# EAGLE design main (EAGLE 5.11)
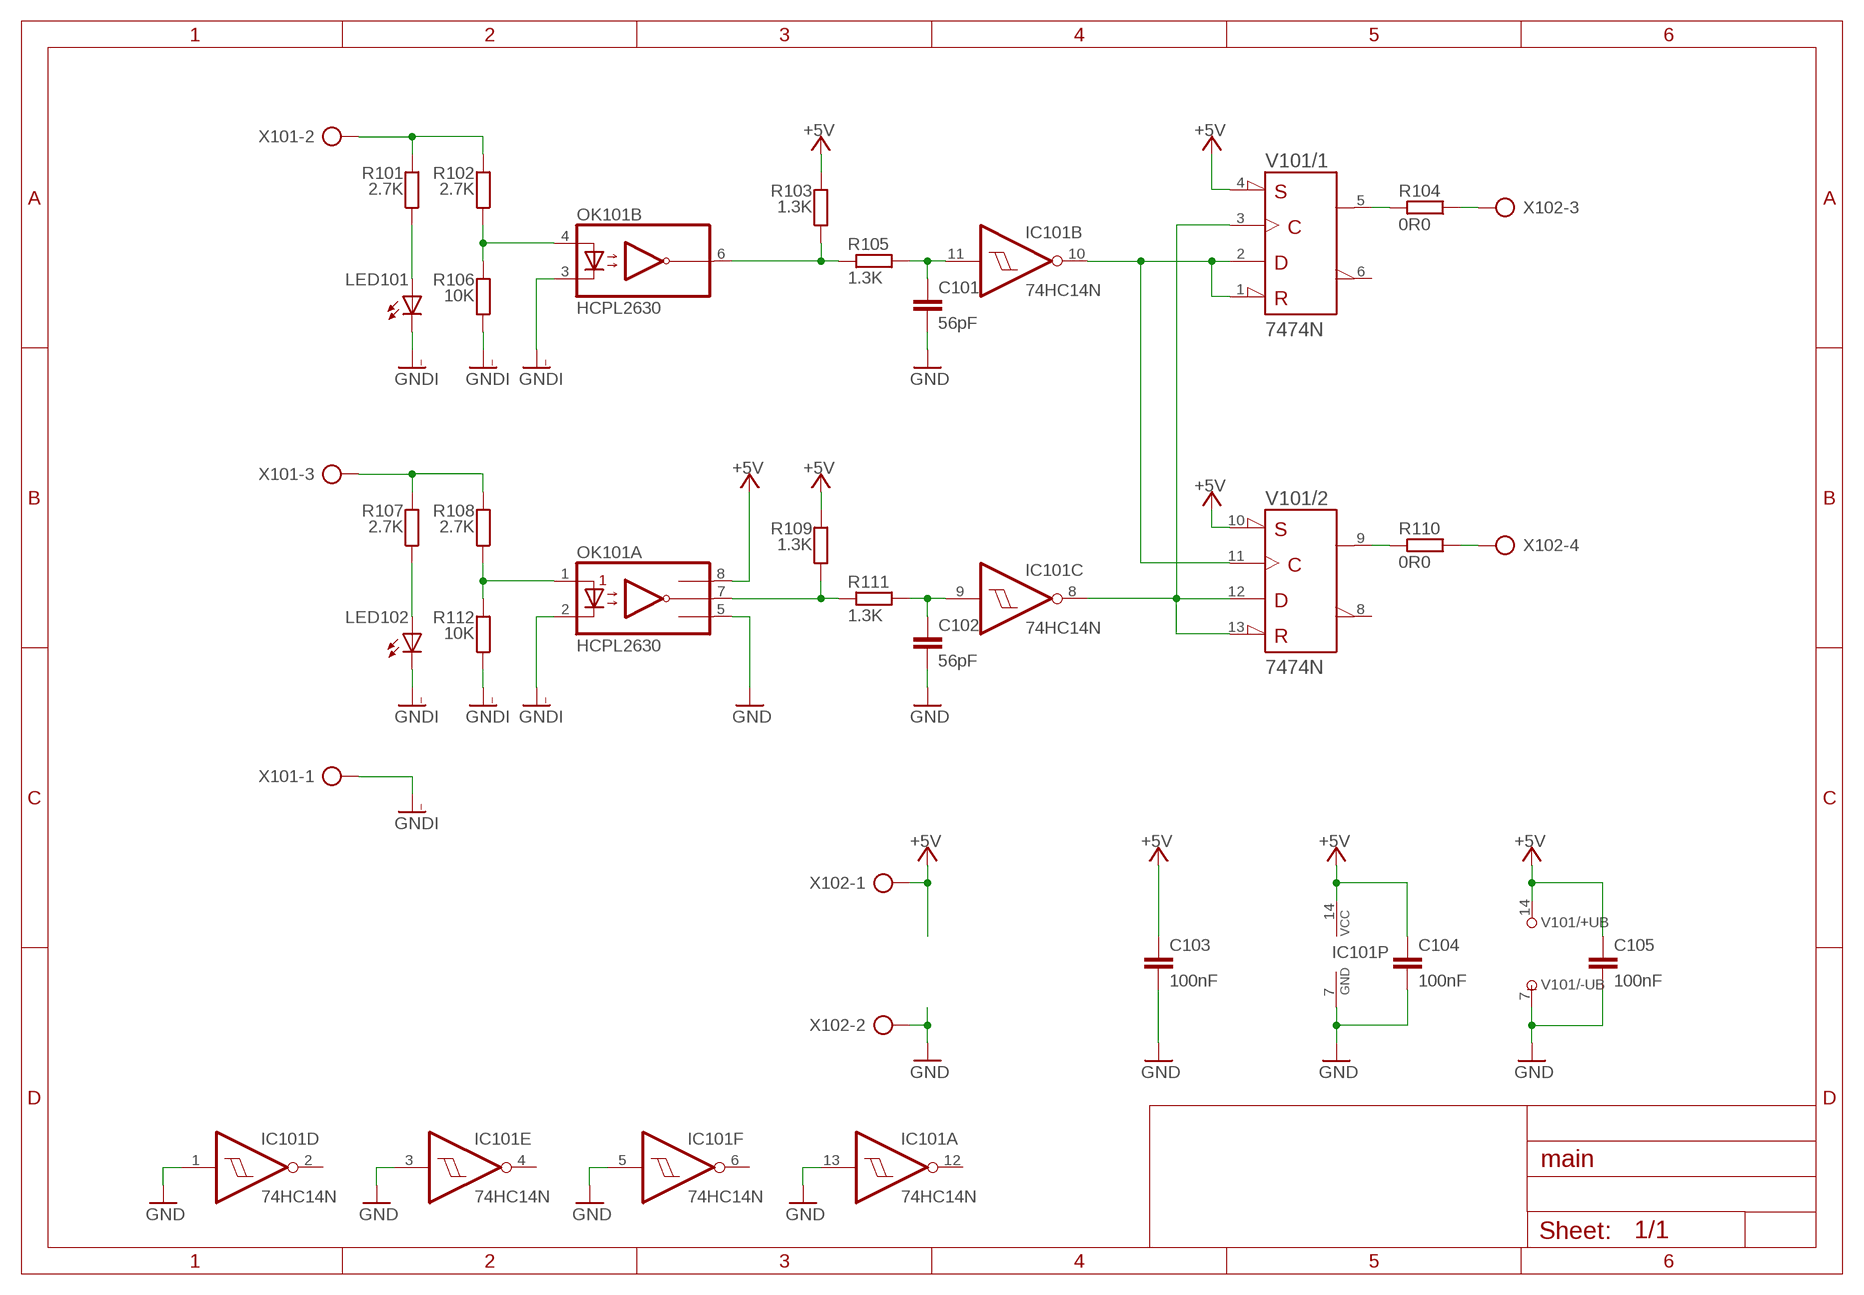
[diagram p0: schematic, sheet 1]

## Parts
C101  56pF  C-EU050-024X044  [C050-024X044]
C102  56pF  C-EU050-024X044  [C050-024X044]
C103  100nF  C-EUC1206  [C1206]
C104  100nF  C-EUC1206  [C1206]
C105  100nF  C-EUC1206  [C1206]
IC101  74HC14N  [DIL14]
LED101  LED5MM  [LED5MM]
LED102  LED5MM  [LED5MM]
OK101  HCPL2630  [DIL08]
R101  2.7K  R-EU_0204/7  [0204/7]
R102  2.7K  R-EU_0204/7  [0204/7]
R103  1.3K  R-EU_0204/7  [0204/7]
R104  0R0  R-EU_0204/7  [0204/7]
R105  1.3K  R-EU_0204/7  [0204/7]
R106  10K  R-EU_0204/7  [0204/7]
R107  2.7K  R-EU_0204/7  [0204/7]
R108  2.7K  R-EU_0204/7  [0204/7]
R109  1.3K  R-EU_0204/7  [0204/7]
R110  0R0  R-EU_0204/7  [0204/7]
R111  1.3K  R-EU_0204/7  [0204/7]
R112  10K  R-EU_0204/7  [0204/7]
V101  7474N  [DIL14]
X101  AK500/3-H  [AK500/3-H]
X102  AK500/4-H  [AK500/4-H]

## Nets
+5V: C103.1 C104.1 C105.1 IC101.14(P:VCC) OK101.8(A:VCC) R103.2 R109.2 V101.4(/1:!PRE) V101.10(/2:!PRE) V101.14(/+UB:+UB) X102.1
GND: C101.2 C102.2 C103.2 C104.2 C105.2 IC101.1(D:I) IC101.3(E:I) IC101.5(F:I) IC101.7(P:GND) IC101.13(A:I) OK101.5(A:GND) V101.7(/-UB:-UB) X102.2
GNDI: LED101.K(C) LED102.K(C) OK101.2(A:C1) OK101.3(B:C2) R106.1 R112.1 X101.1
N$1: OK101.6(B:VO2) R103.1 R105.2
N$2: OK101.7(A:VO1) R109.1 R111.2
N$3: C102.1 IC101.9(C:I) R111.1
N$4: C101.1 IC101.11(B:I) R105.1
N$6: R104.2 V101.5(/1:Q)
N$7: IC101.10(B:O) V101.1(/1:!CLR) V101.2(/1:D) V101.11(/2:CLK)
N$8: IC101.8(C:O) V101.3(/1:CLK) V101.12(/2:D) V101.13(/2:!CLR)
N$9: R110.2 V101.9(/2:Q)
N$10: R101.2 R102.2 X101.2
N$15: OK101.4(B:A2) R102.1 R106.2
N$16: OK101.1(A:A1) R108.1 R112.2
N$22: R107.2 R108.2 X101.3
N$23: LED101.A R101.1
N$24: LED102.A R107.1
N$25: R104.1 X102.3
N$26: R110.1 X102.4
Unconnected: IC101.2(D:O) IC101.4(E:O) IC101.6(F:O) IC101.12(A:O) V101.6(/1:!Q) V101.8(/2:!Q)

## Library data of the parts
C101-C105 = rcl:C-EU: CAPACITOR, European symbol
IC101 = 74xx-eu:74*14: Hex schmitt trigger INVERTER
LED101 LED102 = led:LED: LED OSRAM: - CHIPLED LG R971, LG N971, LY N971, LG Q971, LY Q971, LO R971, LY R971 LH N974, LH R974 LS Q976, LO Q976, LY Q976 LO Q996 - Hyper CHIPLED LW Q18S LB Q993, LB Q99A, LB R99A - SideLED LS A670, LO A670, LY A670, LG A670, LP A670 LB A673, LV A673, LT A673, LW A673 LH A674 LY A675 LS A676, LA A676, LO A676, LY A676, LW A676 LS A679, LY A679, LG A679 - Hyper Micro SIDELED® LS Y876, LA Y876, LO Y876, LY Y876 LT Y87S - SmartLED LW L88C, LW L88S LB L89C, LB L89S, LG L890 LS L89K, LO L89K, LY L89K LS L896, LA L896, LO L896, LY L896 - TOPLED LS T670, LO T670, LY T670, LG T670, LP T670 LSG T670, LSP T670, LSY T670, LOP T670, LYG T670 LG T671, LOG T671, LSG T671 LB T673, LV T673, LT T673, LW T673 LH T674 LS T676, LA T676, LO T676, LY T676, LB T676, LH T676, LSB T676, LW T676 LB T67C, LV T67C, LT T67C, LS T67K, LO T67K, LY T67K, LW E67C LS E67B, LA E67B, LO E67B, LY E67B, LB E67C, LV E67C, LT E67C LW T67C LS T679, LY T679, LG T679 LS T770, LO T770, LY T770, LG T770, LP T770 LB T773, LV T773, LT T773, LW T773 LH T774 LS E675, LA E675, LY E675, LS T675 LS T776, LA T776, LO T776, LY T776, LB T776 LHGB T686 LT T68C, LB T68C - Hyper Mini TOPLED® LB M676 - Mini TOPLED Santana® LG M470 LS M47K, LO M47K, LY M47K Source: http://www.osram.convergy.de LUXEON: - LUMILED® LXK2-PW12-R00, LXK2-PW12-S00, LXK2-PW14-U00, LXK2-PW14-V00 LXK2-PM12-R00, LXK2-PM12-S00, LXK2-PM14-U00 LXK2-PE12-Q00, LXK2-PE12-R00, LXK2-PE12-S00, LXK2-PE14-T00, LXK2-PE14-U00 LXK2-PB12-K00, LXK2-PB12-L00, LXK2-PB12-M00, LXK2-PB14-N00, LXK2-PB14-P00, LXK2-PB14-Q00 LXK2-PR12-L00, LXK2-PR12-M00, LXK2-PR14-Q00, LXK2-PR14-R00 LXK2-PD12-Q00, LXK2-PD12-R00, LXK2-PD12-S00 LXK2-PH12-R00, LXK2-PH12-S00 LXK2-PL12-P00, LXK2-PL12-Q00, LXK2-PL12-R00 Source: www.luxeon.com KINGBRIGHT: KA-3528ASYC Source: www.kingbright.com
OK101 = optocoupler:HCPL2630: HEWLETT PACKARD OPTO COUPLER; MF: AGILENT TECHNOLOGIES; MPN: HCPL-2630-000E; OC_FARNELL: 9994904; OC_NEWARK: 88H7813
R101-R112 = rcl:R-EU_: RESISTOR, European symbol
V101 = 74ttl-din:74*74: Dual D type positive edge triggered FLIP FLOP, preset and clear
X101 = con-ptr500:AK500/3-H: CONNECTOR Aug. 2004 / PTR Meßtechnik: Die Bezeichnung der Serie AK505 wurde geändert. Es handelt sich hierbei um AK500 in horizontaler Ausführung.; OC_FARNELL: unknown; OC_NEWARK: unknown
X102 = con-ptr500:AK500/4-H: CONNECTOR Aug. 2004 / PTR Meßtechnik: Die Bezeichnung der Serie AK505 wurde geändert. Es handelt sich hierbei um AK500 in horizontaler Ausführung.; OC_FARNELL: unknown; OC_NEWARK: unknown

## Board
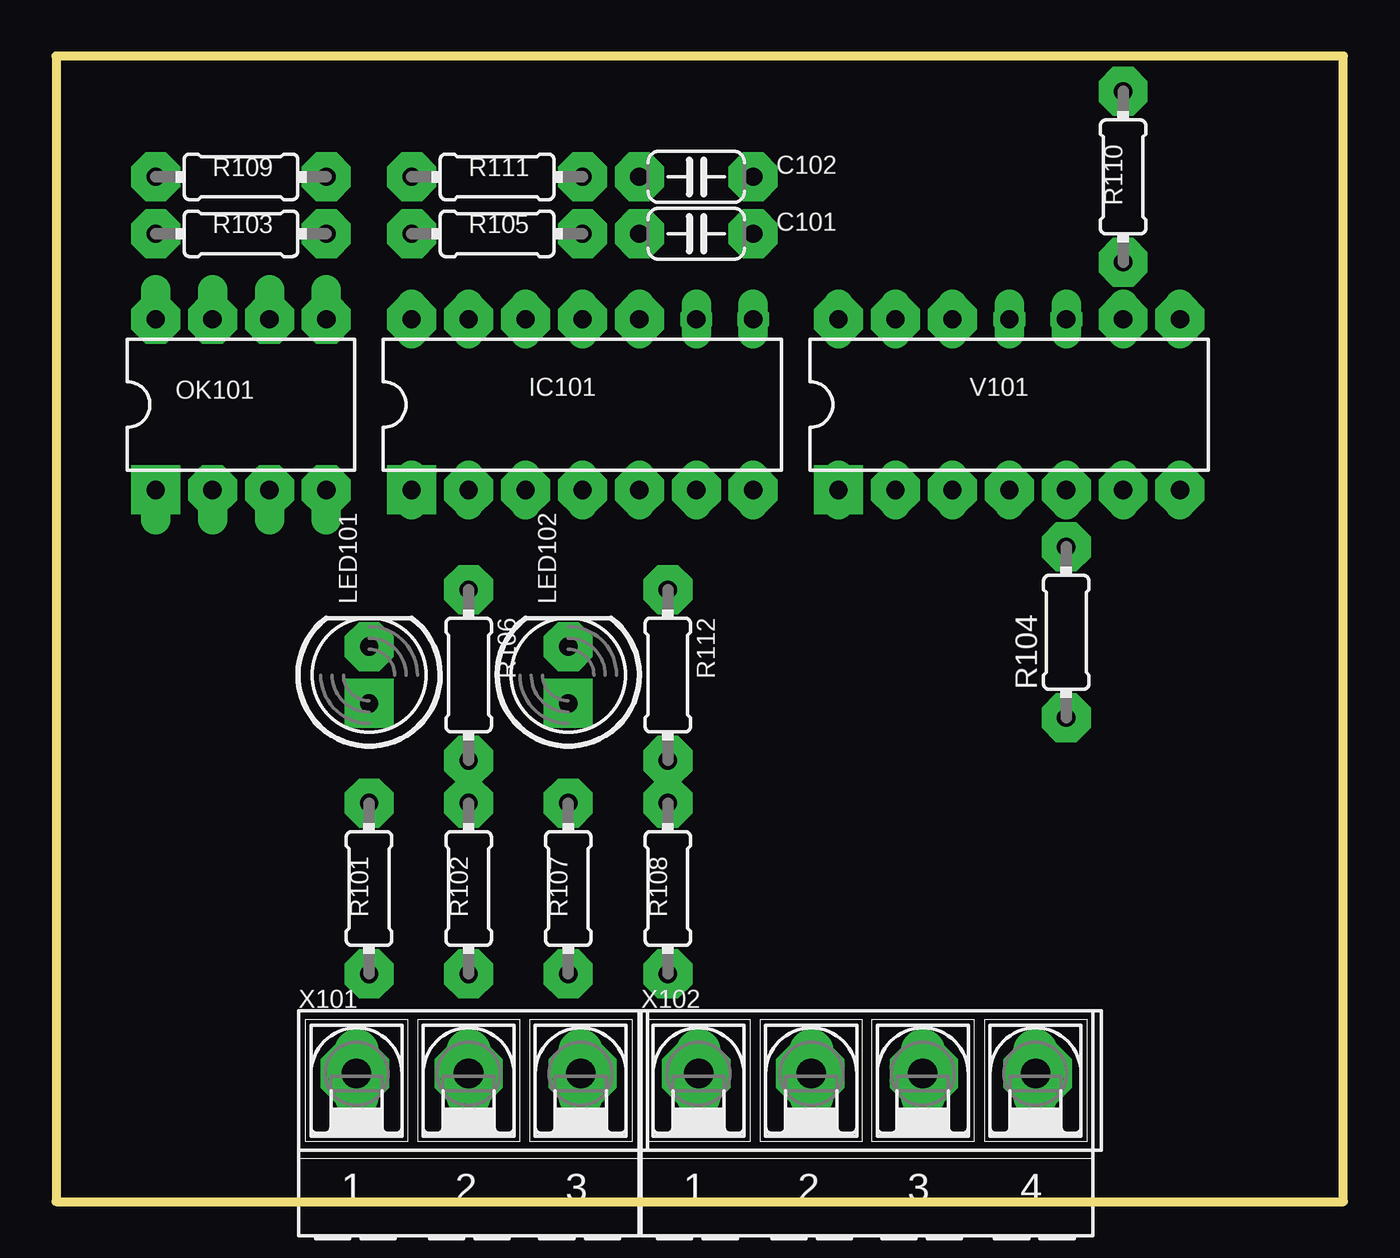
[diagram p1: board, top side]
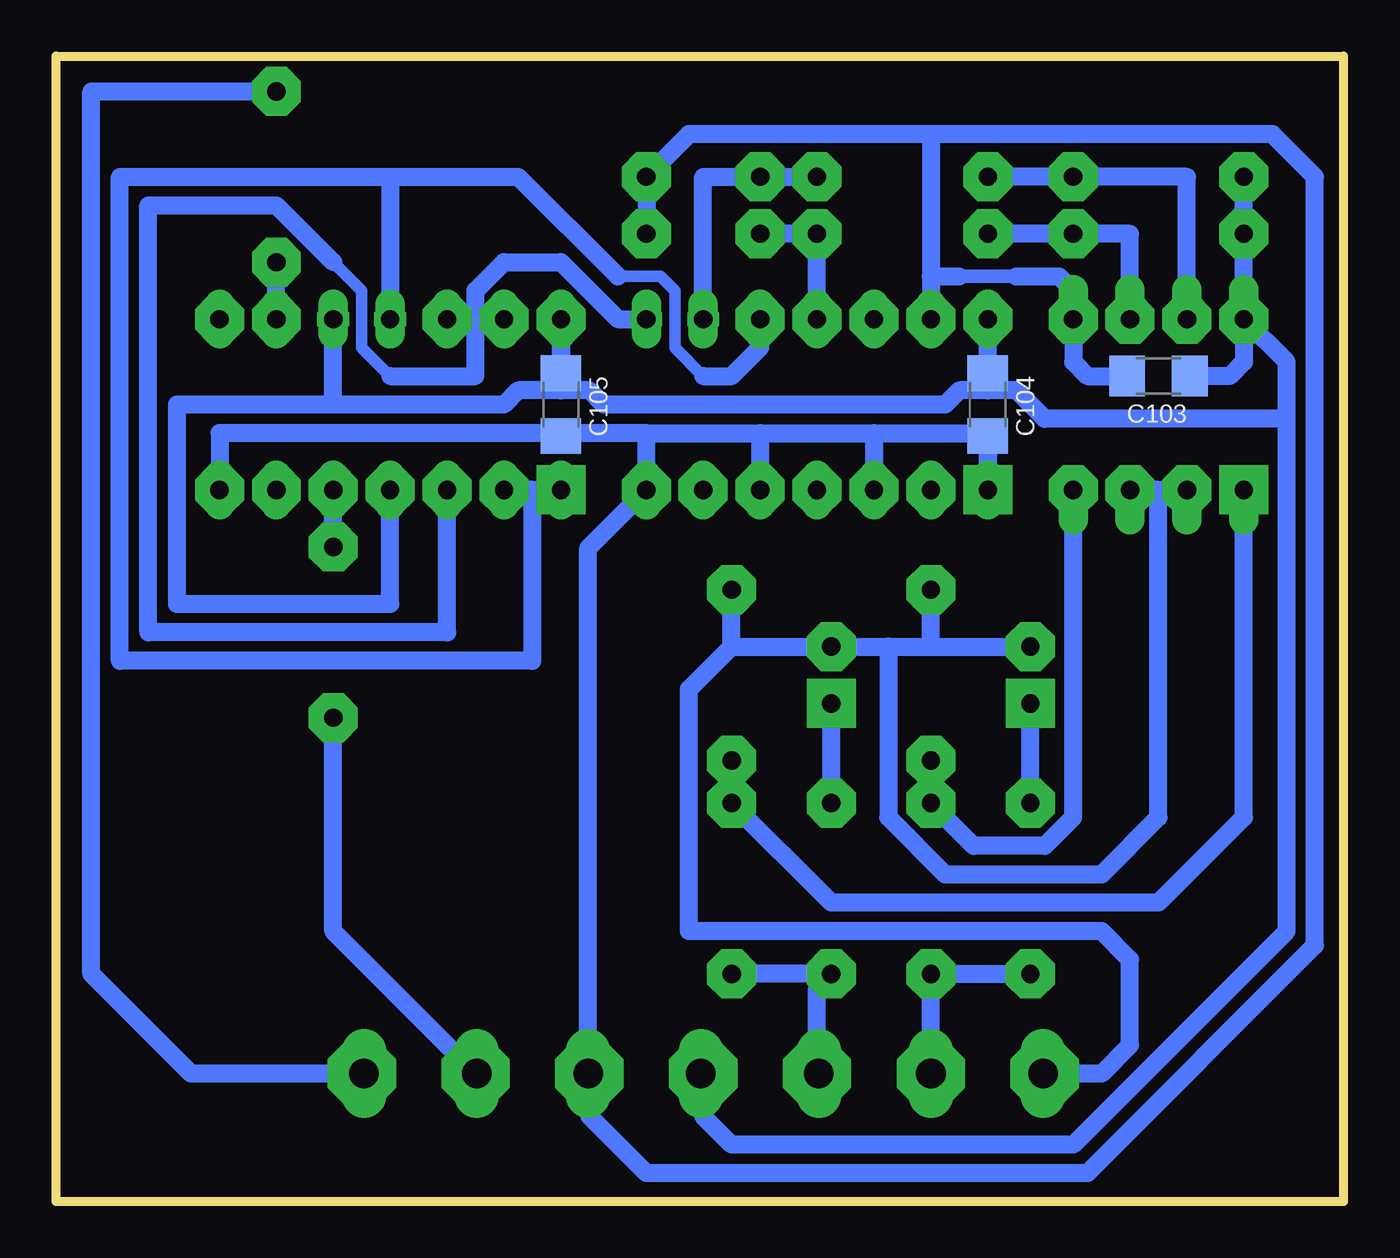
[diagram p2: board, bottom side, seen from below]

Size 57.46 x 51.11 mm. Coordinates in mm from the lower left corner, seen from the top.
Outline: 0,0 57.46,0 57.46,51.11 0,51.11 0,0
Copper layers (1*16): Top 0.035mm / dielectric 1.5mm / Bottom 0.035mm
Design rules "default": minimum track width 10mil, minimum drill 24mil, track to track 8mil, track to pad 8mil, pad to pad 8mil, via to via 8mil, smd to smd 8mil, copper to edge 40mil, drill to drill 8mil, minimum pad ring 10mil, minimum via ring 8mil, stop-mask expansion 4mil, vias tented up to drill 0mil, thermal gap 10mil

### Footprints (pad centres in the part's own frame; a part is rotated, then mirrored left to right if it is on the bottom)
C050-024X044 = drill 0.813 octagon: 1 -2.54,0; 2 2.54,0
C1206 = smd 1.6 x 1.8: 1 -1.4,0; 2 1.4,0
DIL14 = drill 0.813 long: 1 -7.62,-3.81; 2 -5.08,-3.81; 3 -2.54,-3.81; 4 0,-3.81; 5 2.54,-3.81; 6 5.08,-3.81; 7 7.62,-3.81; 8 7.62,3.81; 9 5.08,3.81; 10 2.54,3.81; 11 0,3.81; 12 -2.54,3.81; 13 -5.08,3.81; 14 -7.62,3.81
LED5MM = drill 0.813 octagon: A -1.27,0; K 1.27,0
DIL08 = drill 0.813 offset: 1 -3.81,-3.81; 2 -1.27,-3.81; 3 1.27,-3.81; 4 3.81,-3.81; 5 3.81,3.81; 6 1.27,3.81; 7 -1.27,3.81; 8 -3.81,3.81
0204/7 = drill 0.813 octagon: 1 -3.81,0; 2 3.81,0
AK500/3-H = drill 1.321 long: 1 -5.004,0; 2 0,0; 3 5.004,0
AK500/4-H = drill 1.321 long: 1 -7.518,0; 2 -2.489,0; 3 2.489,0; 4 7.518,0

### Placement (x,y rotation side)
C101  28.57,43.18 0 top
C102  28.57,45.72 0 top
C103  8.26,36.83 180 bottom
C104  15.88,35.56 270 bottom
C105  34.92,35.56 270 bottom
IC101  23.5,35.56 0 top
LED101  13.97,23.5 90 top
LED102  22.86,23.5 90 top
OK101  8.26,35.56 0 top
R101  13.97,13.97 270 top
R102  18.41,13.97 270 top
R103  8.26,43.18 180 top
R104  45.09,25.4 90 top
R105  19.68,43.18 180 top
R106  18.41,23.5 270 top
R107  22.86,13.97 270 top
R108  27.3,13.97 270 top
R109  8.26,45.72 180 top
R110  47.62,45.72 270 top
R111  19.68,45.72 180 top
R112  27.3,23.5 270 top
V101  42.55,35.56 0 top
X101  18.41,5.71 0 top
X102  36.2,5.71 0 top

### Tracks (layer width: path | path; a pad name or v marks a point on that pad's centre or on a via)
+5V  (via drill 0.5 pad 1.42, 0.5 pad 2.18, 0.5 pad 3.05)
  Bottom 0.813: OK101.8 R103.2 R109.2 | 15.88,36.2 17.14,36.2 17.78,35.56 33.02,35.56 33.66,36.2 34.92,36.2 | 34.92,36.2 36.83,36.2 37.47,35.56 45.09,35.56 | 45.09,35.56 V101.10 | IC101.14 C104.1 15.88,36.2 | C105.1 v34.92,39.37 34.92,36.2 | 45.09,35.56 52.07,35.56 52.07,26.67 42.55,26.67 V101.4 | 2.54,34.92 2.54,12.06 12.06,2.54 27.3,2.54 28.57,3.81 v28.57,5.71 X102.1 | 2.54,34.92 2.54,37.47 OK101.8 | C103.1 5.08,36.83 4.45,37.47 OK101.8 | 15.88,36.2 14.61,36.2 13.34,34.92 2.54,34.92
  other vias: 4.45,39.37 15.88,39.37 4.45,43.18 4.45,45.72 42.55,31.75 45.09,39.37
GND  (via drill 0.5 pad 2.18, 0.5 pad 3.05)
  Bottom 0.61: 17.14,41.27 14.61,41.27
  Bottom 0.813: C104.2 IC101.1 15.88,34.29 20.95,34.29 | C101.2 C102.2 29.21,47.62 18.41,47.62 | V101.7 50.16,34.29 34.92,34.29 | 26.04,34.29 20.95,34.29 | 31.11,34.29 26.04,34.29 | 31.11,34.29 34.92,34.29 | 20.95,34.29 IC101.3 | 26.04,34.29 IC101.5 | 31.11,34.29 v31.11,31.75 33.71,29.16 X102.2 33.66,5.66 v33.66,5.71 33.66,3.81 31.11,1.27 11.43,1.27 1.27,11.43 1.27,45.72 3.17,47.62 18.41,47.62 | 34.92,34.29 C105.2 | C103.2 11.43,36.83 12.06,37.47 v12.06,39.37 12.06,40.64 12.7,41.27 14.61,41.27 | 18.41,47.62 18.41,41.27 | 18.41,41.27 17.14,41.27 | 18.41,41.27 IC101.13
  other vias: 18.41,39.37 31.11,45.72 31.11,43.18 50.16,31.75
GNDI  (via drill 0.5 pad 2.18, 0.5 pad 3.05)
  Bottom 0.813: 18.41,24.77 LED101.K | 18.41,24.77 LED102.K 27.3,24.77 | 18.41,24.77 R106.1 | 27.3,24.77 R112.1 | 8.26,31.75 OK101.2 | 8.26,31.75 OK101.3 | 8.26,31.75 8.26,17.14 10.79,14.61 17.78,14.61 20.32,17.14 20.32,24.77 | X101.1 v13.34,5.71 10.79,5.71 9.53,6.99 9.53,10.79 10.79,12.06 29.21,12.06 29.21,22.86 27.3,24.77
  other vias: 6.99,31.75 9.53,31.75 18.41,27.3 27.3,27.3 13.97,24.77 22.86,24.77
N$1  (via drill 0.5 pad 2.18)
  Bottom 0.813: OK101.6 9.53,43.18 v12.06,43.18 v15.88,43.18
  other vias: 9.53,39.37
N$2  (via drill 0.5 pad 2.18)
  Bottom 0.813: OK101.7 6.99,45.72 v12.06,45.72 v15.88,45.72
  other vias: 6.99,39.37
N$3  (via drill 0.5 pad 1.42, 0.5 pad 2.18)
  Bottom 0.813: v23.5,45.72 C102.1 28.57,45.72 v28.57,39.37
  other vias: 26.04,45.72
N$4  (via drill 0.5 pad 2.18)
  Bottom 0.813: IC101.11 v23.5,43.18 C101.1
  other vias: 23.5,39.37 26.04,43.18
N$5  (via drill 0.5 pad 2.18)
  other vias: 15.88,31.75
N$6  (via drill 0.5 pad 2.18)
  Bottom 0.813: R104.2 V101.5
  other vias: 45.09,31.75 45.09,29.21
N$7  (via drill 0.5 pad 1.42, 0.5 pad 2.18)
  Bottom 0.508: 28.57,36.83 29.84,38.1 29.84,40.64 30.48,41.27 32.38,41.27
  Bottom 0.813: 36.2,31.75 V101.2 | 28.57,36.83 27.3,36.83 26.04,38.1 IC101.10 | 32.38,41.27 36.83,45.72 42.55,45.72 | 36.2,31.75 v34.92,31.75 | 36.2,31.75 36.2,24.13 54.61,24.13 54.61,45.72 42.55,45.72 | 42.55,45.72 V101.11
  other vias: 26.04,39.37 37.47,31.75 42.55,39.37
N$8  (via drill 0.5 pad 1.42, 0.5 pad 2.18)
  Bottom 0.508: 45.09,41.91 43.81,40.64 43.81,38.1 42.55,36.83
  Bottom 0.813: 38.73,39.37 V101.13 | 38.73,39.37 V101.12 | v31.11,39.37 32.38,39.37 34.92,41.91 37.47,41.91 38.73,40.64 38.73,39.37 | V101.3 40.01,25.4 53.34,25.4 53.34,44.45 47.62,44.45 45.09,41.91 | 42.55,36.83 38.73,36.83 38.73,39.37
  other vias: 37.47,39.37 40.01,39.37 40.01,31.75
N$9  (via drill 0.5 pad 2.18)
  Bottom 0.813: V101.9 R110.2
  other vias: 47.62,39.37 47.62,41.91
N$10  (via drill 0.5 pad 2.18, 0.5 pad 3.05)
  Bottom 0.813: R101.2 R102.2 X101.2
  other vias: 13.97,10.16 18.41,10.16 18.41,5.71
N$11  (via drill 0.5 pad 2.18)
  other vias: 20.95,39.37
N$12  (via drill 0.5 pad 2.18)
  other vias: 18.41,39.37
N$13  (via drill 0.5 pad 3.05)
  other vias: 23.5,5.71
N$15  (via drill 0.5 pad 2.18)
  Bottom 0.813: v18.41,19.68 R102.1 16.51,15.88 13.34,15.88 12.06,17.14 v12.06,31.75
  other vias: 18.41,17.78
N$16  (via drill 0.5 pad 2.18)
  Bottom 0.813: v27.3,19.68 R108.1 22.86,13.34 8.26,13.34 4.45,17.14 OK101.1
  other vias: 4.45,31.75 27.3,17.78
N$17  (via drill 0.5 pad 2.18)
  other vias: 18.41,31.75
N$18  (via drill 0.5 pad 2.18)
  other vias: 20.95,31.75
N$19  (via drill 0.5 pad 2.18)
  other vias: 23.5,31.75
N$20  (via drill 0.5 pad 2.18)
  other vias: 26.04,31.75
N$21  (via drill 0.5 pad 2.18)
  other vias: 28.57,31.75
N$22  (via drill 0.5 pad 2.18)
  Bottom 0.813: R107.2 23.5,10.16 | R107.2 R108.2 | X101.3 23.5,5.71 23.5,9.53 R107.2
  other vias: 22.86,10.16 27.3,10.16
N$23  (via drill 0.5 pad 2.18)
  Bottom 0.813: R101.1 LED101.A
  other vias: 13.97,22.23 13.97,17.78
N$24  (via drill 0.5 pad 2.18)
  Bottom 0.813: R107.1 LED102.A
  other vias: 22.86,17.78 22.86,22.23
N$25  (via drill 0.5 pad 2.18, 0.5 pad 3.05)
  Bottom 0.813: R104.1 45.09,12.06 v38.73,5.71 X102.3
  other vias: 45.09,21.59
N$26  (via drill 0.5 pad 2.18, 0.5 pad 3.05)
  Bottom 0.813: R110.1 55.88,49.53 55.88,10.16 51.44,5.71 v43.81,5.71 X102.4
  other vias: 47.62,49.53
N$27  (via drill 0.5 pad 2.18)
  other vias: 47.62,31.75
N$28  (via drill 0.5 pad 2.18)
  other vias: 50.16,39.37